# EAGLE schematic SmartWatch_SCH (EAGLE 9.7.0)
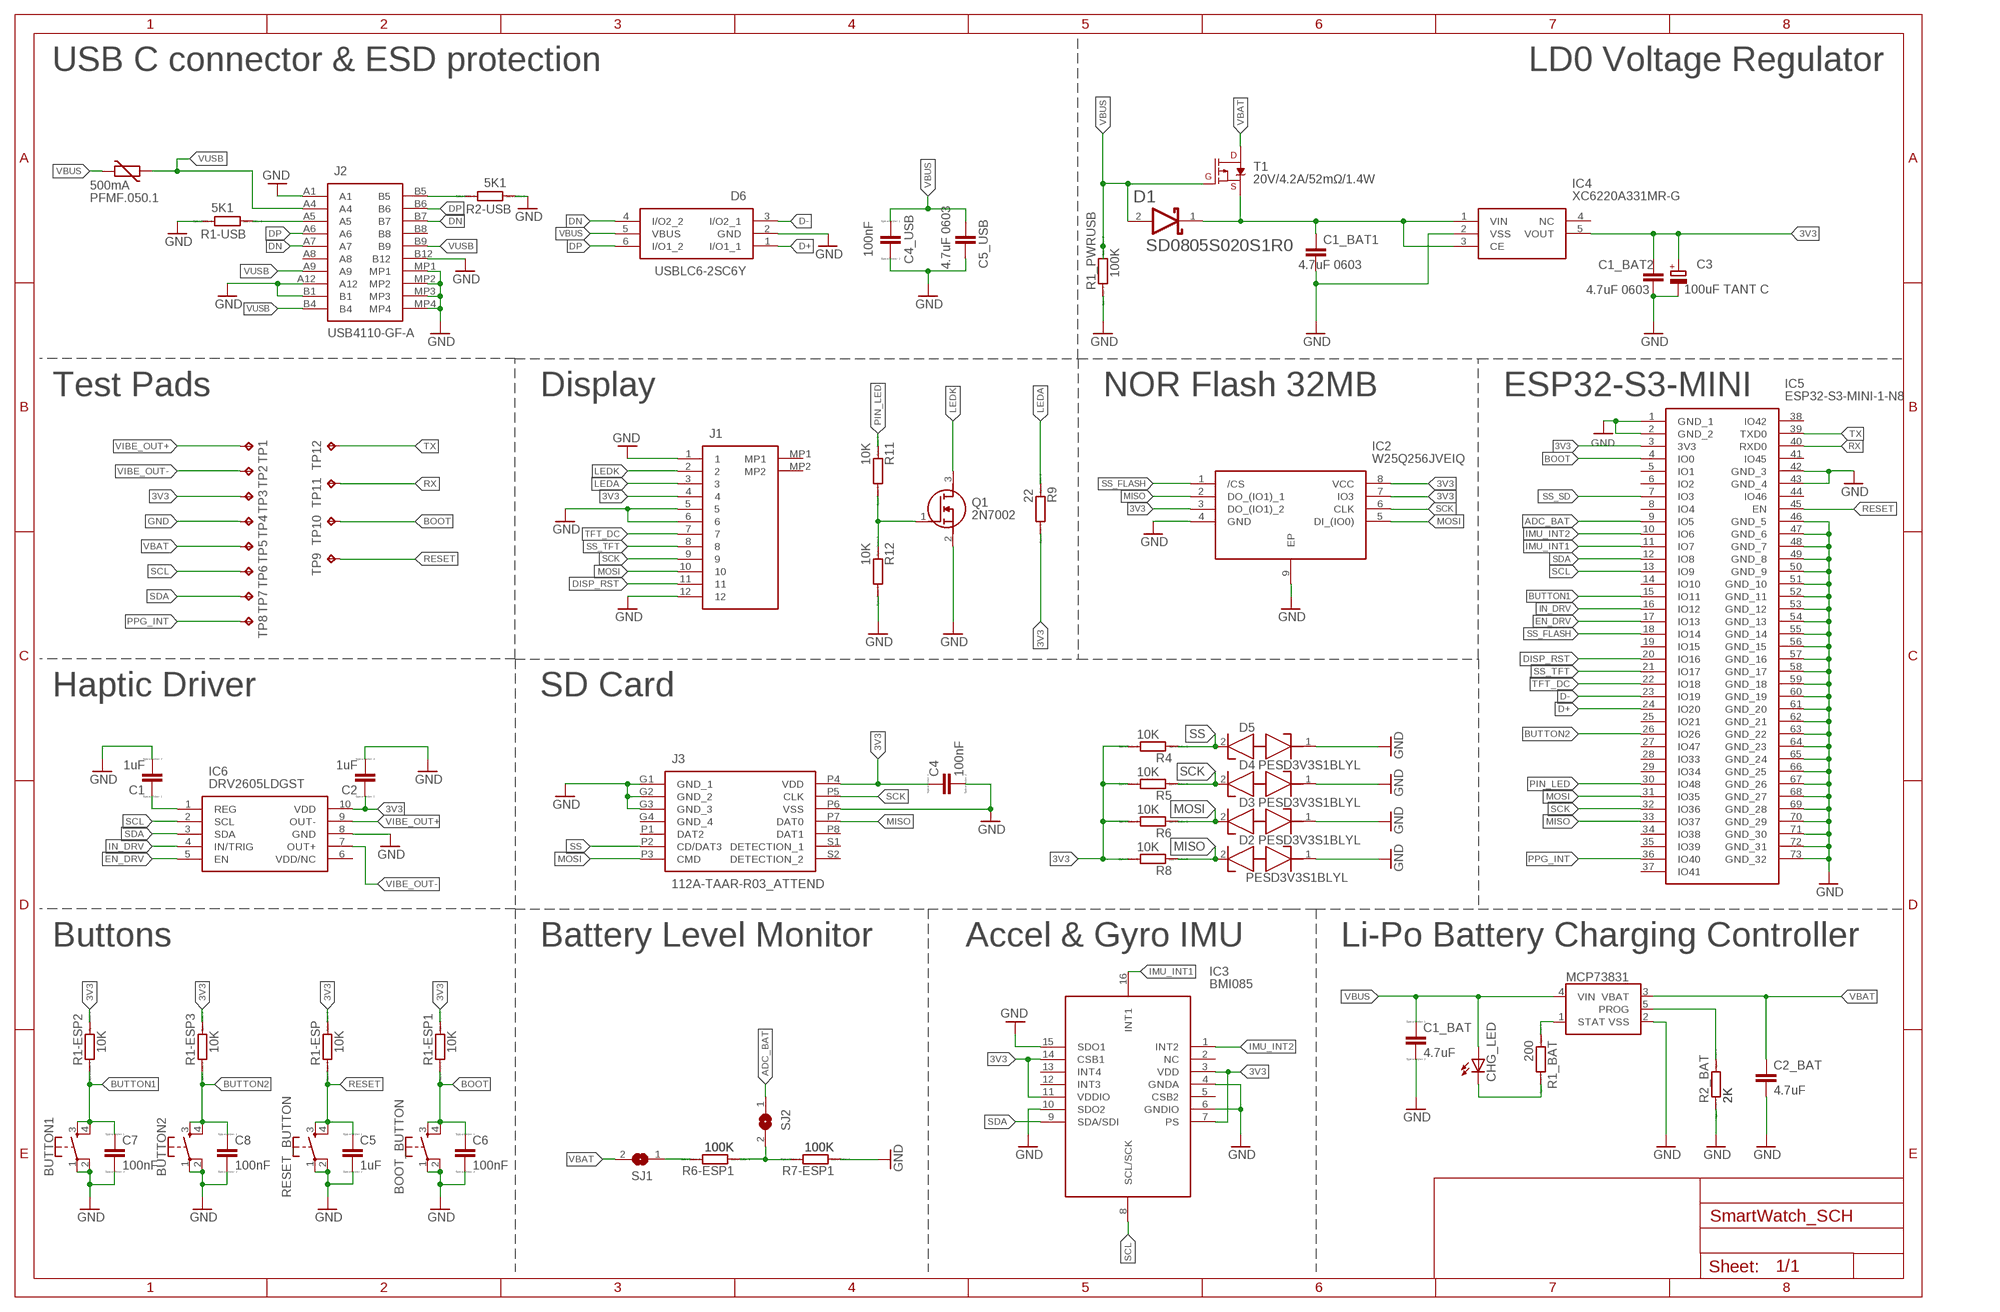
[diagram p0: schematic, sheet 1]

## Parts
BOOT_BUTTON  SPARKFUN-SWITCHES_MOMENTARY-SWITCH-SPST-2-SMD-4.6X2.8MM  [SPARKFUN-SWITCHES_TACTILE_SWITCH_SMD_4.6X2.8MM]
BUTTON1  SPARKFUN-SWITCHES_MOMENTARY-SWITCH-SPST-2-SMD-4.6X2.8MM  [SPARKFUN-SWITCHES_TACTILE_SWITCH_SMD_4.6X2.8MM]
BUTTON2  SPARKFUN-SWITCHES_MOMENTARY-SWITCH-SPST-2-SMD-4.6X2.8MM  [SPARKFUN-SWITCHES_TACTILE_SWITCH_SMD_4.6X2.8MM]
C1  1uF  EAGLE-LTSPICE_CC0402  [EAGLE-LTSPICE_C0402]
C1_BAT  4.7uF  EAGLE-LTSPICE_CC0402  [EAGLE-LTSPICE_C0402]
C1_BAT1  4.7uF 0603  RCL_C-EUC0603  [RCL_C0603]
C1_BAT2  4.7uF 0603  RCL_C-EUC0603  [RCL_C0603]
C2  1uF  EAGLE-LTSPICE_CC0402  [EAGLE-LTSPICE_C0402]
C2_BAT  4.7uF  RCL_C-EUC0603  [RCL_C0603]
C3  100uF TANT C  CPOL-EUCT3528  [CT3528]
C4  100nF  EAGLE-LTSPICE_CC0402  [EAGLE-LTSPICE_C0402]
C4_USB  100nF  EAGLE-LTSPICE_CC0402  [EAGLE-LTSPICE_C0402]
C5  1uF  EAGLE-LTSPICE_CC0402  [EAGLE-LTSPICE_C0402]
C5_USB  4.7uF 0603  RCL_C-EUC0603  [RCL_C0603]
C6  100nF  EAGLE-LTSPICE_CC0402  [EAGLE-LTSPICE_C0402]
C7  100nF  EAGLE-LTSPICE_CC0402  [EAGLE-LTSPICE_C0402]
C8  100nF  EAGLE-LTSPICE_CC0402  [EAGLE-LTSPICE_C0402]
CHG_LED  ADAFRUIT_LEDCHIP-LED0603  [ADAFRUIT_CHIP-LED0603]
D1  AVX---SD0805S020S1R0_AVX_SD0805S020S1R0AVX_SD0805S020S1R0_0_0  [AVX---SD0805S020S1R0_AVX_SD0805S020S1R0_0]
D2  PESD3V3S1BLYL  [PESD5V0S1BL315]
D3  PESD3V3S1BLYL  [PESD5V0S1BL315]
D4  PESD3V3S1BLYL  [PESD5V0S1BL315]
D5  PESD3V3S1BLYL  [PESD5V0S1BL315]
D6  USBLC6-2SC6Y  [SOT95P280X145-6N]
IC2  W25Q256JVEIQ  [SON127P800X600X80-9N]
IC3  BMI085  [BMI085]
IC4  XC6220A331MR-G  [SOT95P280X120-5N]
IC5  ESP32-S3-MINI-1-N8  [ESP32S3MINI1N8]
IC6  DRV2605LDGST  [SOP50P490X110-10N]
J1  PCA-6-LA-12-HL-3-T_R  [PCA6LA12HL3TR]
J2  USB4110-GF-A  [USB4110GFA]
J3  112A-TAAR-R03_ATTEND  [112ATAARR03ATTEND]
MCP73831  SPARKFUN-IC-POWER_MCP73831  [SPARKFUN-IC-POWER_SOT23-5]
PFMF.050.1  500mA  VARISTOR_VARISTORCN1812  [VARISTOR_CT/CN1812]
Q1  2N7002  [SOT96P240X120-3N]
R1-ESP  10K  EAGLE-LTSPICE_RR0402  [EAGLE-LTSPICE_R0402]
R1-ESP1  10K  EAGLE-LTSPICE_RR0402  [EAGLE-LTSPICE_R0402]
R1-ESP2  10K  EAGLE-LTSPICE_RR0402  [EAGLE-LTSPICE_R0402]
R1-ESP3  10K  EAGLE-LTSPICE_RR0402  [EAGLE-LTSPICE_R0402]
R1-USB  5K1  EAGLE-LTSPICE_RR0402  [EAGLE-LTSPICE_R0402]
R1_BAT  200  EAGLE-LTSPICE_RR0402  [EAGLE-LTSPICE_R0402]
R1_PWRUSB  100K  EAGLE-LTSPICE_RR0402  [EAGLE-LTSPICE_R0402]
R2-USB  5K1  EAGLE-LTSPICE_RR0402  [EAGLE-LTSPICE_R0402]
R2_BAT  2K  EAGLE-LTSPICE_RR0402  [EAGLE-LTSPICE_R0402]
R4  10K  EAGLE-LTSPICE_RR0402  [EAGLE-LTSPICE_R0402]
R5  10K  EAGLE-LTSPICE_RR0402  [EAGLE-LTSPICE_R0402]
R6  10K  EAGLE-LTSPICE_RR0402  [EAGLE-LTSPICE_R0402]
R6-ESP1  100K  EAGLE-LTSPICE_RR0402  [EAGLE-LTSPICE_R0402]
R7-ESP1  100K  EAGLE-LTSPICE_RR0402  [EAGLE-LTSPICE_R0402]
R8  10K  EAGLE-LTSPICE_RR0402  [EAGLE-LTSPICE_R0402]
R9  22  EAGLE-LTSPICE_RR0402  [EAGLE-LTSPICE_R0402]
R11  10K  EAGLE-LTSPICE_RR0402  [EAGLE-LTSPICE_R0402]
R12  10K  EAGLE-LTSPICE_RR0402  [EAGLE-LTSPICE_R0402]
RESET_BUTTON  SPARKFUN-SWITCHES_MOMENTARY-SWITCH-SPST-2-SMD-4.6X2.8MM  [SPARKFUN-SWITCHES_TACTILE_SWITCH_SMD_4.6X2.8MM]
SJ1  SJ  [SJ]
SJ2  SJ  [SJ]
T1  20V/4.2A/52mΩ/1.4W  SPARKFUN-DISCRETESEMI_MOSFET_PCH-DMG2305UX-7  [SPARKFUN-DISCRETESEMI_SOT23-3]
TP1  TPTP20R  [TP20R]
TP2  TPTP20R  [TP20R]
TP3  TPTP20R  [TP20R]
TP4  TPTP20R  [TP20R]
TP5  TPTP20R  [TP20R]
TP6  TPTP20R  [TP20R]
TP7  TPTP20R  [TP20R]
TP8  TPTP20R  [TP20R]
TP9  TPTP20R  [TP20R]
TP10  TPTP20R  [TP20R]
TP11  TPTP20R  [TP20R]
TP12  TPTP20R  [TP20R]

## Nets
3V3: C1_BAT2.1 C2.1 C3.+ C4.1 IC2.3(DO_(IO1)_2) IC2.7(IO3) IC2.8(VCC) IC3.3(VDD) IC3.7(PS) IC3.11(VDDIO) IC3.14(CSB1) IC4.5(VOUT) IC5.3(3V3) IC6.10(VDD) J1.4 J3.P4(VDD) R1-ESP1.2 R1-ESP2.2 R1-ESP3.2 R1-ESP.2 R4.2 R5.2 R6.2 R8.2 R9.1 TP3.TP
ADC_BAT: IC5.9(IO5) SJ2.1
BOOT: BOOT_BUTTON.3 BOOT_BUTTON.4 C6.1 IC5.4(IO0) R1-ESP1.1 TP10.TP
BUTTON1: BUTTON1.3 BUTTON1.4 C7.1 IC5.15(IO11) R1-ESP2.1
BUTTON2: BUTTON2.3 BUTTON2.4 C8.1 IC5.26(IO26) R1-ESP3.1
D+: D6.1(I/O1_1) IC5.24(IO20)
D-: D6.3(I/O2_1) IC5.23(IO19)
DISP_RST: IC5.20(IO16) J1.11
DN: D6.4(I/O2_2) J2.A7 J2.B7
DP: D6.6(I/O1_2) J2.A6 J2.B6
EN_DRV: IC5.17(IO13) IC6.5(EN)
GND: BOOT_BUTTON.1 BOOT_BUTTON.2 BUTTON1.1 BUTTON1.2 BUTTON2.1 BUTTON2.2 C1.2 C1_BAT1.2 C1_BAT2.2 C1_BAT.2 C2.2 C2_BAT.2 C3.- C4.2 C4_USB.2 C5.2 C5_USB.2 C6.2 C7.2 C8.2 D2.1(K1) D3.1(K1) D4.1(K1) D5.1(K1) D6.2(GND) IC2.4(GND) IC2.9(EP) IC3.4(GNDA) IC3.6(GNDIO) IC3.10(SDO2) IC3.15(SDO1) IC4.2(VSS) IC5.1(GND_1) IC5.2(GND_2) IC5.42(GND_3) IC5.43(GND_4) IC5.46(GND_5) IC5.47(GND_6) IC5.48(GND_7) IC5.49(GND_8) IC5.50(GND_9) IC5.51(GND_10) IC5.52(GND_11) IC5.53(GND_12) IC5.54(GND_13) IC5.55(GND_14) IC5.56(GND_15) IC5.57(GND_16) IC5.58(GND_17) IC5.59(GND_18) IC5.60(GND_19) IC5.61(GND_20) IC5.62(GND_21) IC5.63(GND_22) IC5.64(GND_23) IC5.65(GND_24) IC5.66(GND_25) IC5.67(GND_26) IC5.68(GND_27) IC5.69(GND_28) IC5.70(GND_29) IC5.71(GND_30) IC5.72(GND_31) IC5.73(GND_32) IC6.8(GND) J1.1 J1.5 J1.6 J1.12 J2.A1 J2.A12 J2.B1 J2.B12 J2.MP1 J2.MP2 J2.MP3 J2.MP4 J3.G1(GND_1) J3.G2(GND_2) J3.G3(GND_3) J3.P6(VSS) MCP73831.2(VSS) Q1.2(S) R1-USB.2 R1_PWRUSB.1 R2-USB.1 R2_BAT.1 R7-ESP1.1 R12.1 RESET_BUTTON.1 RESET_BUTTON.2 TP4.TP
IMU_INT1: IC3.16(INT1) IC5.11(IO7)
IMU_INT2: IC3.1(INT2) IC5.10(IO6)
IN_DRV: IC5.16(IO12) IC6.4(IN/TRIG)
LEDA: J1.3 R9.2
LEDK: J1.2 Q1.3(D)
MISO: D2.2(K2) IC2.2(DO_(IO1)_1) IC5.33(IO37) J3.P7(DAT0) R8.1
MOSI: D3.2(K2) IC2.5(DI_(IO0)) IC5.31(IO35) J1.10 J3.P3(CMD) R6.1
N$1: Q1.1(G) R11.1 R12.2
N$2: C1_BAT1.1 D1.1(CATHODE) IC4.1(VIN) IC4.3(CE) T1.2(S)
N$3: R6-ESP1.1 R7-ESP1.2 SJ2.2
N$4: J2.A5 R1-USB.1
N$5: R6-ESP1.2 SJ1.1
N$6: J2.B5 R2-USB.2
N$7: MCP73831.5(PROG) R2_BAT.2
N$12: MCP73831.1(STAT) R1_BAT.1
N$13: C1.1 IC6.1(REG)
N$14: CHG_LED.C R1_BAT.2
PIN_LED: IC5.30(IO48) R11.2
PPG_INT: IC5.36(IO40) TP8.TP
RESET: C5.1 IC5.45(EN) R1-ESP.1 RESET_BUTTON.3 RESET_BUTTON.4 TP9.TP
RX: IC5.40(RXD0) TP11.TP
SCK: D4.2(K2) IC2.6(CLK) IC5.32(IO36) J1.9 J3.P5(CLK) R5.1
SCL: IC3.8(SCL/SCK) IC5.13(IO9) IC6.2(SCL) TP6.TP
SDA: IC3.9(SDA/SDI) IC5.12(IO8) IC6.3(SDA) TP7.TP
SS: D5.2(K2) J3.P2(CD/DAT3) R4.1
SS_FLASH: IC2.1(/CS) IC5.18(IO14)
SS_SD: IC5.7(IO3)
SS_TFT: IC5.21(IO17) J1.8
TFT_DC: IC5.22(IO18) J1.7
TX: IC5.39(TXD0) TP12.TP
VBAT: C2_BAT.1 MCP73831.3(VBAT) SJ1.2 T1.3(D) TP5.TP
VBUS: C1_BAT.1 C4_USB.1 C5_USB.1 CHG_LED.A D1.2(ANODE) D6.5(VBUS) MCP73831.4(VIN) PFMF.050.1.2 R1_PWRUSB.2 T1.1(G)
VIBE_OUT+: IC6.9(OUT-) TP1.TP
VIBE_OUT-: IC6.7(OUT+) TP2.TP
VUSB: J2.A4 J2.A9 J2.B4 J2.B9 PFMF.050.1.1
Unconnected: IC3.2(NC) IC3.5(CSB2) IC3.12(INT3) IC3.13(INT4) IC4.4(NC) IC5.5(IO1) IC5.6(IO2) IC5.8(IO4) IC5.14(IO10) IC5.19(IO15) IC5.25(IO21) IC5.27(IO47) IC5.28(IO33) IC5.29(IO34) IC5.34(IO38) IC5.35(IO39) IC5.37(IO41) IC5.38(IO42) IC5.41(IO45) IC5.44(IO46) IC6.6(VDD/NC) J1.MP1 J1.MP2 J2.A8 J2.B8 J3.G4(GND_4) J3.P1(DAT2) J3.P8(DAT1) J3.S1(DETECTION_1) J3.S2(DETECTION_2)

## Notes on the sheet
- USB C connector & ESD protection | LD0 Voltage Regulator
- Test Pads | Display | NOR Flash 32MB | ESP32-S3-MINI
- Haptic Driver | SD Card
- Buttons | Battery Level Monitor | Accel & Gyro IMU | Li-Po Battery Charging Controller

## Library data of the parts
BOOT_BUTTON BUTTON1 BUTTON2 RESET_BUTTON = Library_Buttons:SPARKFUN-SWITCHES_MOMENTARY-SWITCH-SPST-2: Momentary Switch (Pushbutton) - SPST - Two Circuits Normally-open (NO) SPST momentary switches (buttons, pushbuttons). Schematic symbol includes two switch circuits. Variants SMD-4.6MMX2.8MM - 4.60mm x 2.80mm Tactile Momentary Button Switch - Used on SparkFun SAMD21 Mini Breakout <https://www.sparkfun.com/products/13664> SMD-5.2MM - Mini Pushbutton Switch - SMD <https://www.sparkfun.com/products/8720> - Used on Arduino Pro Mini <https://www.sparkfun.com/products/11114>; PROD_ID: SWCH-14139; SF_SKU: COM-08720
C1 C1_BAT C2 C4 C4_USB C5-C8 = Hector_Watch:EAGLE-LTSPICE_C: CAPACITOR, European symbol; SPICEMODEL: NONE; SPICEPREFIX: C
C1_BAT1 C1_BAT2 C2_BAT C5_USB = Hector_Watch:RCL_C-EU: CAPACITOR, European symbol; SPICEPREFIX: C
C3 = Hector_Watch:CPOL-EU: POLARIZED CAPACITOR, European symbol; SPICEPREFIX: C
CHG_LED = Hector_Watch:ADAFRUIT_LED: LED OSRAM: - CHIPLED LG R971, LG N971, LY N971, LG Q971, LY Q971, LO R971, LY R971 LH N974, LH R974 LS Q976, LO Q976, LY Q976 LO Q996 - Hyper CHIPLED LW Q18S LB Q993, LB Q99A, LB R99A - SideLED LS A670, LO A670, LY A670, LG A670, LP A670 LB A673, LV A673, LT A673, LW A673 LH A674 LY A675 LS A676, LA A676, LO A676, LY A676, LW A676 LS A679, LY A679, LG A679 - Hyper Micro SIDELED® LS Y876, LA Y876, LO Y876, LY Y876 LT Y87S - SmartLED LW L88C, LW L88S LB L89C, LB L89S, LG L890 LS L89K, LO L89K, LY L89K LS L896, LA L896, LO L896, LY L896 - TOPLED LS T670, LO T670, LY T670, LG T670, LP T670 LSG T670, LSP T670, LSY T670, LOP T670, LYG T670 LG T671, LOG T671, LSG T671 LB T673, LV T673, LT T673, LW T673 LH T674 LS T676, LA T676, LO T676, LY T676, LB T676, LH T676, LSB T676, LW T676 LB T67C, LV T67C, LT T67C, LS T67K, LO T67K, LY T67K, LW E67C LS E67B, LA E67B, LO E67B, LY E67B, LB E67C, LV E67C, LT E67C LW T67C LS T679, LY T679, LG T679 LS T770, LO T770, LY T770, LG T770, LP T770 LB T773, LV T773, LT T773, LW T773 LH T774 LS E675, LA E675, LY E675, LS T675 LS T776, LA T776, LO T776, LY T776, LB T776 LHGB T686 LT T68C, LB T68C - Hyper Mini TOPLED® LB M676 - Mini TOPLED Santana® LG M470 LS M47K, LO M47K, LY M47K Source: http://www.osram.convergy.de/
D1 = Hector_Watch:AVX---SD0805S020S1R0_AVX_SD0805S020S1R0: Schottky Barrier Rectifier Diode; CENTROID_NOT_SPECIFIED: No; DATASHEET: http://datasheets.avx.com/schottky.pdf; DIGIKEY_DESCRIPTION: DIODE SCHOTTKY 20V 1A 0805; DIGIKEY_PART_NUMBER: 478-7800-1-ND; LEAD_FREE: yes; MF: AVX; MOUSER_PART_NUMBER: 581-SD0805S020S1R0; MPN: SD0805S020S1R0; PACKAGE: 0805 (2012 metric); PREFIX: D; ROHS: yes; TEMPERATURE_RANGE_HIGH: +125°C; TEMPERATURE_RANGE_LOW: -55°C
D2-D5 = Hector_Watch:PESD3V3S1BLYL: PESD3V3S1BL - Low capacitance bidirectional ESD protection diode Source: Datasheet <https://assets.nexperia.com/documents/data-sheet/PESD3V3S1BL.pdf>; ARROW_PART_NUMBER: PESD3V3S1BLYL; ARROW_PRICE-STOCK: https://www.arrow.com/en/products/pesd3v3s1blyl/nexperia?region=nac; DESCRIPTION: PESD3V3S1BL - Low capacitance bidirectional ESD protection diode; HEIGHT: 0mm; MANUFACTURER_NAME: Nexperia; MANUFACTURER_PART_NUMBER: PESD3V3S1BLYL; MOUSER_PART_NUMBER: 771-PESD3V3S1BLYL; MOUSER_PRICE-STOCK: https://www.mouser.co.uk/ProductDetail/Nexperia/PESD3V3S1BLYL?qs=vLWxofP3U2zWoKHYJMVoKQ%3D%3D
D6 = Hector_Watch:USBLC6-2SC6Y: Low Cap. ESD Protection Auto SOT-23-6 STMicroelectronics USBLC6-2SC6Y, Dual Uni-Directional TVS Diode Array, 6-Pin SOT-23 Source: Datasheet <https://componentsearchengine.com/Datasheets/1/USBLC6-2SC6Y.pdf>; ARROW_PART_NUMBER: USBLC6-2SC6Y; ARROW_PRICE-STOCK: https://www.arrow.com/en/products/usblc6-2sc6y/stmicroelectronics?region=nac; DESCRIPTION: Low Cap. ESD Protection Auto SOT-23-6 STMicroelectronics USBLC6-2SC6Y, Dual Uni-Directional TVS Diode Array, 6-Pin SOT-23; HEIGHT: 1.45mm; MANUFACTURER_NAME: STMicroelectronics; MANUFACTURER_PART_NUMBER: USBLC6-2SC6Y; MOUSER_PART_NUMBER: 511-USBLC6-2SC6Y; MOUSER_PRICE-STOCK: https://www.mouser.co.uk/ProductDetail/STMicroelectronics/USBLC6-2SC6Y?qs=gNDSiZmRJS%2FOgDexvXkdow%3D%3D
IC2 = Hector_Watch:W25Q256JVEIQ: 256M-bit Serial Flash Memory with uniform 4KB sectors and Dual/Quad SPI Source: Datasheet <https://www.winbond.com/hq/search-resource-file.jsp?partNo=W25Q256JVEIQ&type=datasheet>; ARROW_PART_NUMBER: W25Q256JVEIQ; ARROW_PRICE-STOCK: https://www.arrow.com/en/products/w25q256jveiq/winbond-electronics?region=nac; DESCRIPTION: 256M-bit Serial Flash Memory with uniform 4KB sectors and Dual/Quad SPI; HEIGHT: 0.8mm; MANUFACTURER_NAME: Winbond; MANUFACTURER_PART_NUMBER: W25Q256JVEIQ; MOUSER_PART_NUMBER: 454-W25Q256JVEIQ; MOUSER_PRICE-STOCK: https://www.mouser.co.uk/ProductDetail/Winbond/W25Q256JVEIQ?qs=qSfuJ%252Bfl%2Fd4o%2FNFUf7yCgA%3D%3D
IC3 = Hector_Watch:BMI085: IMUs - Inertial Measurement Units High-performance IMU BMI085 for virtual and augmented reality applications Source: Datasheet <https://ae-bst.resource.bosch.com/media/_tech/media/datasheets/BST-BMI085-DS001.pdf>; ARROW_PART_NUMBER: BMI085; ARROW_PRICE-STOCK: https://www.arrow.com/en/products/bmi085/bosch; DESCRIPTION: IMUs - Inertial Measurement Units High-performance IMU BMI085 for virtual and augmented reality applications; HEIGHT: 1mm; MANUFACTURER_NAME: BOSCH; MANUFACTURER_PART_NUMBER: BMI085; MOUSER_PART_NUMBER: 262-BMI085; MOUSER_PRICE-STOCK: https://www.mouser.co.uk/ProductDetail/Bosch-Sensortec/BMI085?qs=y6ZabgHbY%252ByGCM8LfWZyqA%3D%3D
IC4 = Hector_Watch:XC6220A331MR-G: LDO Voltage Regulators Source: Datasheet <https://www.torexsemi.com/file/xc6220/XC6220.pdf>; DESCRIPTION: LDO Voltage Regulators; HEIGHT: 1.2mm; MANUFACTURER_NAME: Torex; MANUFACTURER_PART_NUMBER: XC6220A331MR-G; MOUSER_PART_NUMBER: 865-XC6220A331MR-G; MOUSER_PRICE-STOCK: https://www.mouser.co.uk/ProductDetail/Torex-Semiconductor/XC6220A331MR-G?qs=AsjdqWjXhJ8ZSWznL1J0gg%3D%3D
IC5 = Hector_Watch:ESP32-S3-MINI-1-N8: WiFi Development Tools - 802.11 [Engineering Samples] SMD Module, ESP32-S3FN8, 8 MB SPI Flash, PCB Antenna Source: Datasheet <https://www.espressif.com/sites/default/files/documentation/esp32-s3-mini-1_mini-1u_datasheet_en.pdf>; DESCRIPTION: WiFi Development Tools - 802.11 [Engineering Samples] SMD Module, ESP32-S3FN8, 8 MB SPI Flash, PCB Antenna; HEIGHT: 2.55mm; MANUFACTURER_NAME: Espressif Systems; MANUFACTURER_PART_NUMBER: ESP32-S3-MINI-1-N8; MOUSER_PART_NUMBER: 356-ESP32-S3-MINI1N8; MOUSER_PRICE-STOCK: https://www.mouser.co.uk/ProductDetail/Espressif-Systems/ESP32-S3-MINI-1-N8?qs=XAiT9M5g4x82rl6F%2FIYUQg%3D%3D
IC6 = Hector_Watch:DRV2605LDGST: ERM & LRA Device Haptic Driver 2-5V BGA9 Texas Instruments DRV2605LDGST Piezo Haptic Motor Driver IC, 5 V, 10-Pin VSSOP Source: Datasheet <http://www.ti.com/lit/ds/symlink/drv2605l.pdf>; ARROW_PART_NUMBER: DRV2605LDGST; ARROW_PRICE-STOCK: https://www.arrow.com/en/products/drv2605ldgst/texas-instruments?region=nac; DESCRIPTION: ERM & LRA Device Haptic Driver 2-5V BGA9 Texas Instruments DRV2605LDGST Piezo Haptic Motor Driver IC, 5 V, 10-Pin VSSOP; HEIGHT: 1.1mm; MANUFACTURER_NAME: Texas Instruments; MANUFACTURER_PART_NUMBER: DRV2605LDGST; MOUSER_PART_NUMBER: 595-DRV2605LDGST; MOUSER_PRICE-STOCK: https://www.mouser.co.uk/ProductDetail/Texas-Instruments/DRV2605LDGST?qs=asCBFxFfL1TjvcNdZsR2BA%3D%3D
J1 = Hector_Watch:PCA-6-LA-12-HL-3-T_R: CONN FFC BOTTOM 12POS 0.5MM R/A Source: Datasheet <https://app.adam-tech.com/products/download/data_sheet/198708/pca-6-la-xx-hl-3-t-r-data-sheet.pdf>; DESCRIPTION: CONN FFC BOTTOM 12POS 0.5MM R/A; HEIGHT: 2.808mm; MANUFACTURER_NAME: Adam Tech; MANUFACTURER_PART_NUMBER: PCA-6-LA-12-HL-3-T/R
J2 = Hector_Watch:USB4110-GF-A: CONN USB 2.0 TYPE-C R/A SMT Source: Datasheet <https://gct.co/files/drawings/usb4110.pdf>; DESCRIPTION: CONN USB 2.0 TYPE-C R/A SMT; HEIGHT: 3.26mm; MANUFACTURER_NAME: GCT (GLOBAL CONNECTOR TECHNOLOGY); MANUFACTURER_PART_NUMBER: USB4110-GF-A; MOUSER_PART_NUMBER: 640-USB4110-GF-A; MOUSER_PRICE-STOCK: https://www.mouser.co.uk/ProductDetail/GCT/USB4110-GF-A?qs=KUoIvG%2F9IlYiZvIXQjyJeA%3D%3D
J3 = Hector_Watch:112A-TAAR-R03_ATTEND: Micro SD Card Socket, Push-Push Type, Top Mount, SMT, H=1.83mm, 10u Source: Datasheet <https://www.attend.com.tw/data/download/file/112A-TAAR-R03.pdf>; DESCRIPTION: Micro SD Card Socket, Push-Push Type, Top Mount, SMT, H=1.83mm, 10u; HEIGHT: 1.9mm; MANUFACTURER_NAME: ATTEND; MANUFACTURER_PART_NUMBER: 112A-TAAR-R03 ATTEND
MCP73831 = Hector_Watch:SPARKFUN-IC-POWER_MCP73831: MCP73831T Li-Ion, Li-Pol Controller Miniature single cell, fully integrated Li-Ion, Li-polymer charge management controller Datasheet <http://ww1.microchip.com/downloads/en/DeviceDoc/20001984g.pdf> SparkFun Products: SparkFun ESP32 Thing <https://www.sparkfun.com/products/13907> SparkFun 9DoF Razor IMU M0 <https://www.sparkfun.com/products/14001>; PROD_ID: IC-09995
PFMF.050.1 = Hector_Watch:VARISTOR_VARISTOR: VARISTOR
Q1 = Hector_Watch:2N7002: N-channel MOSFET,2N7002 0.115A 60V Source: Datasheet <https://www.onsemi.com/pub/Collateral/NDS7002A-D.PDF>; ARROW_PART_NUMBER: 2N7002; ARROW_PRICE-STOCK: https://www.arrow.com/en/products/2n7002/on-semiconductor?region=europe; DESCRIPTION: N-channel MOSFET,2N7002 0.115A 60V; HEIGHT: 1.2mm; MANUFACTURER_NAME: onsemi; MANUFACTURER_PART_NUMBER: 2N7002; MOUSER_PART_NUMBER: 512-2N7002; MOUSER_PRICE-STOCK: https://www.mouser.co.uk/ProductDetail/onsemi-Fairchild/2N7002?qs=0dwsXDNhqlz66WJJhrTFjQ%3D%3D
R1-ESP R1-ESP1-R1-ESP3 R1-USB R1_BAT R1_PWRUSB R2-USB R2_BAT R4-R6 R6-ESP1 R7-ESP1 R8 R9 R11 R12 = Hector_Watch:EAGLE-LTSPICE_R: RESISTOR, European symbol; SPICEMODEL: NONE; SPICEPREFIX: R
SJ1 SJ2 = Hector_Watch:SJ: SMD solder JUMPER
T1 = Hector_Watch:SPARKFUN-DISCRETESEMI_MOSFET_PCH: P-channel MOSFETs Voltage controlled devices that allow control of high current outputs. SparkFun Products: SparkFun ESP32 Thing <https://www.sparkfun.com/products/13907> SparkFun ESP8266 Thing <https://www.sparkfun.com/products/13231> SparkFun Pi Servo HAT V2 <https://www.sparkfun.com/products/15316> DMG2305UX-7 (20V/4.2A/SOT23-3); PROD_ID: TRAN-14388
TP1 TP2 TP4-TP6 TP10 = Hector_Watch:TP: Test pad
TP3 = Hector_Watch:TP: Test pad; TP_SIGNAL_NAME: 3V3
TP7 = Hector_Watch:TP: Test pad; TP_SIGNAL_NAME: SDA
TP8 = Hector_Watch:TP: Test pad; TP_SIGNAL_NAME: PPG_INT
TP9 = Hector_Watch:TP: Test pad; TP_SIGNAL_NAME: RESET
TP11 = Hector_Watch:TP: Test pad; TP_SIGNAL_NAME: RX
TP12 = Hector_Watch:TP: Test pad; TP_SIGNAL_NAME: TX